# Altium schematic sheet POWER.SchDoc
size A3; SheetNumber: 4; SheetTotal: 4
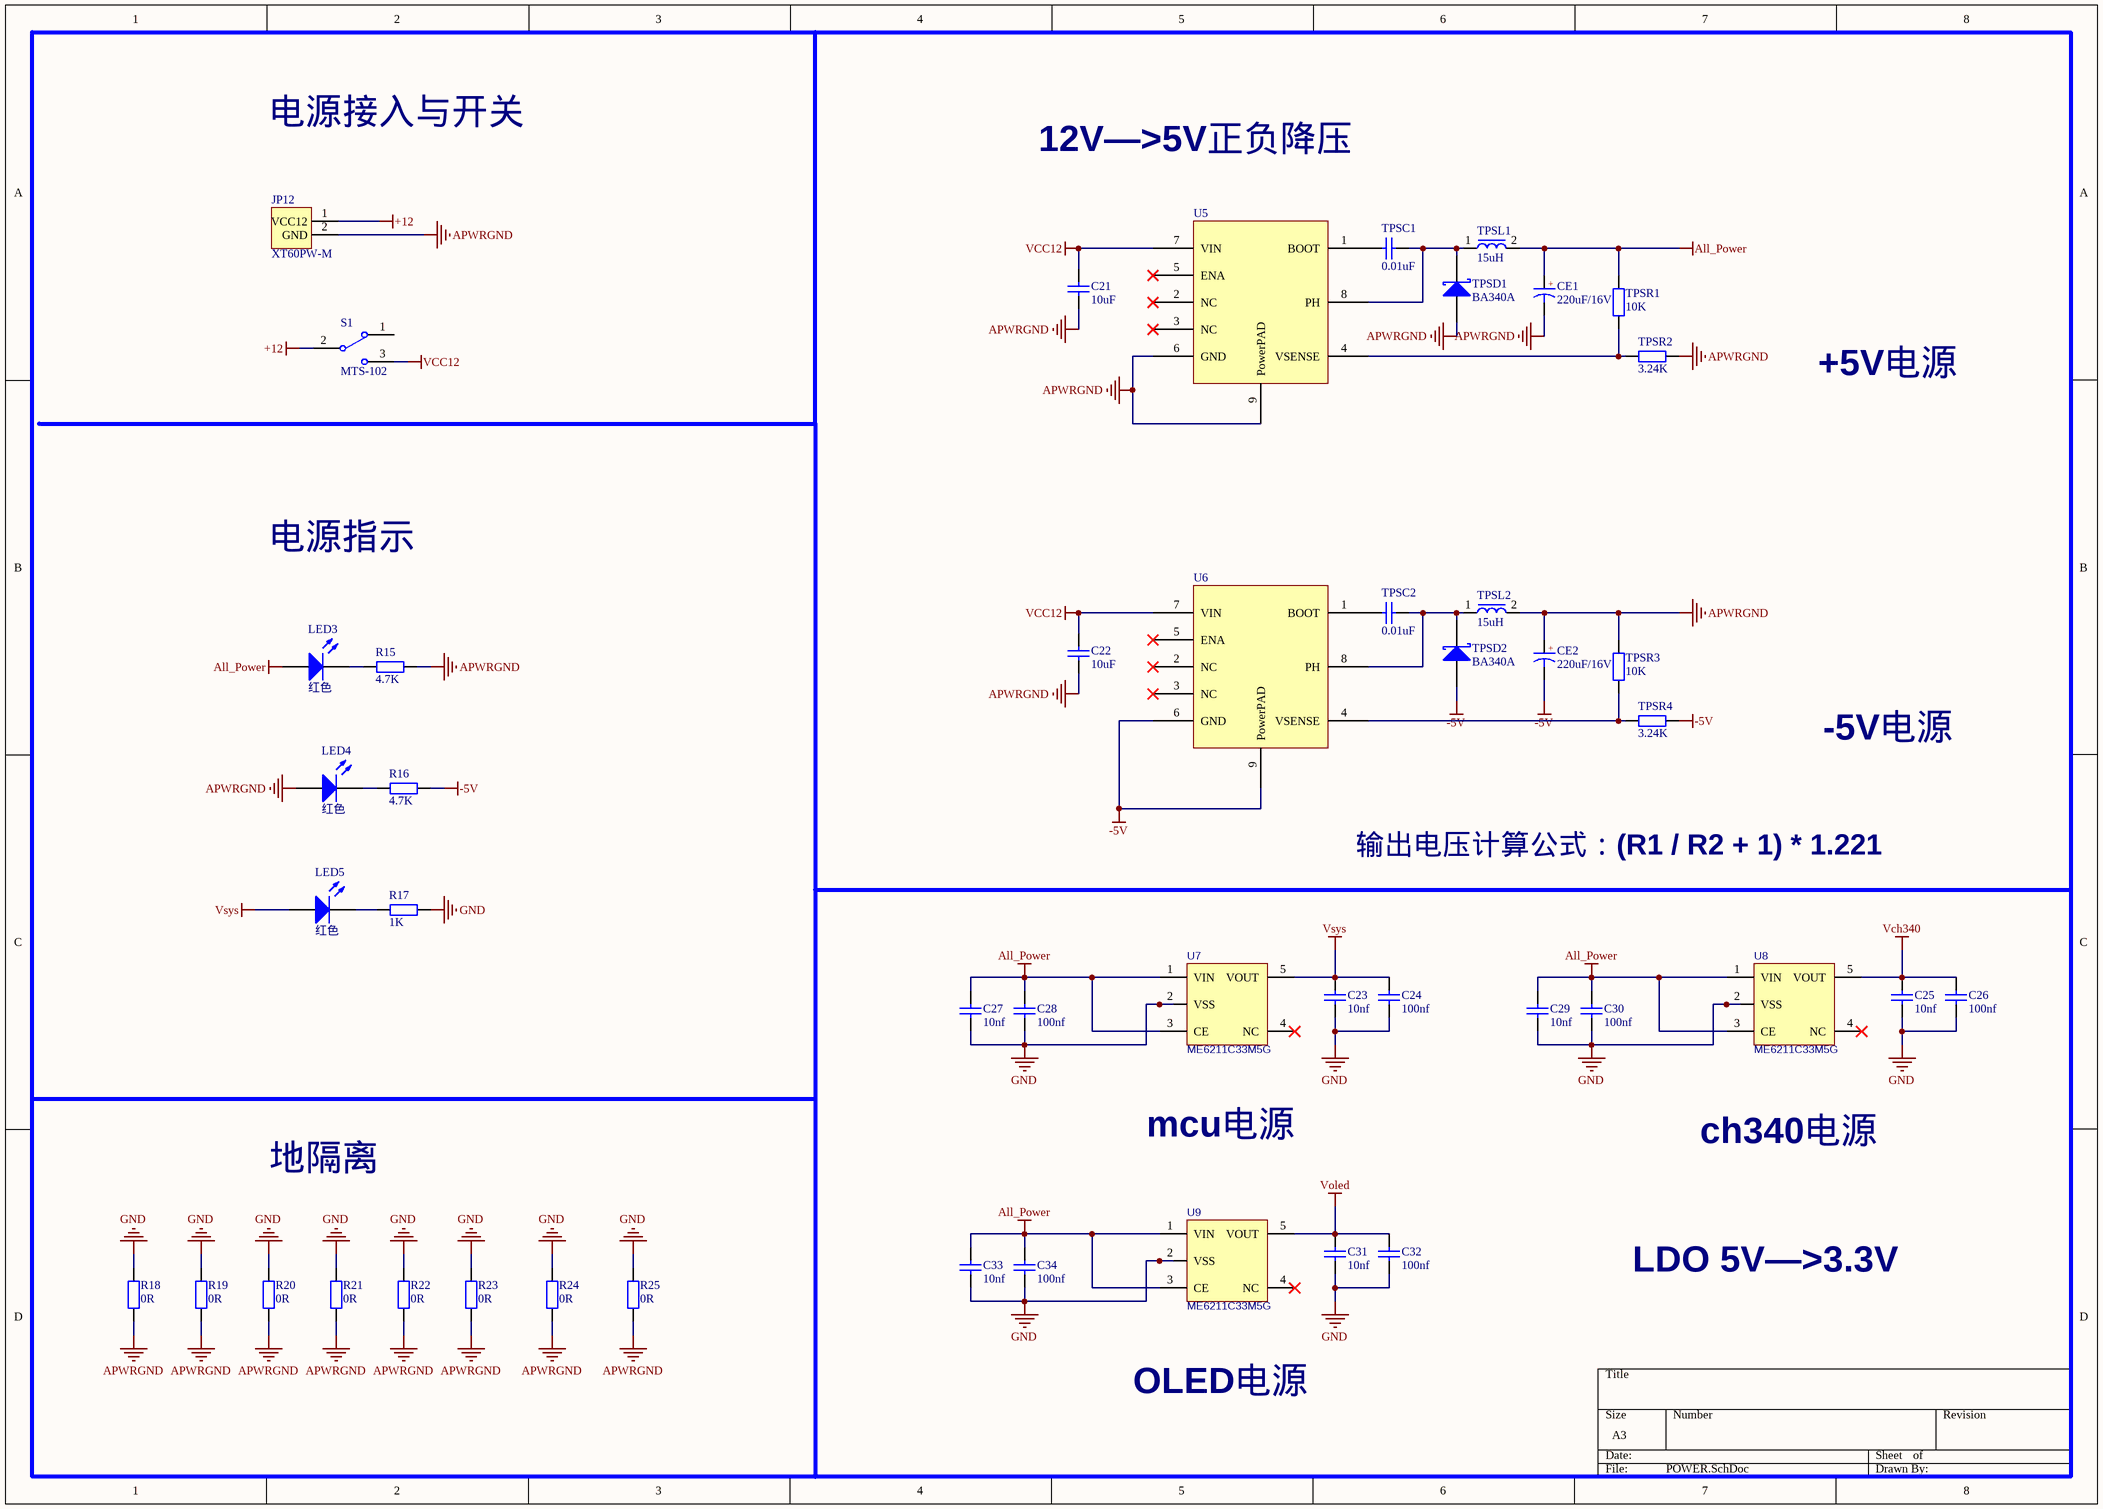
[diagram p0: POWER.SchDoc]

## Parts
C21  10uF  [C0603_M]
C22  10uF  [C0603_M]
C23  10nf  [C0603_M]
C24  100nf  [C0603_M]
C25  10nf  [C0603_M]
C26  100nf  [C0603_M]
C27  10nf  [C0603_M]
C28  100nf  [C0603_M]
C29  10nf  [C0603_M]
C30  100nf  [C0603_M]
C31  10nf  [C0603_M]
C32  100nf  [C0603_M]
C33  10nf  [C0603_M]
C34  100nf  [C0603_M]
CE1  220uF/16V  [CE D(6.3*5.4)]
CE2  220uF/16V  [CE D(6.3*5.4)]
JP12  XT60PW-M  [TX60PW-M20]
LED3  红色  [LED0603_R]
LED4  红色  [LED0603_R]
LED5  红色  [LED0603_R]
R15  4.7K  [R0603_M]
R16  4.7K  [R0603_M]
R17  1K  [R0603_M]
R18  0R  [R0603_M]
R19  0R  [R0603_M]
R20  0R  [R0603_M]
R21  0R  [R0603_M]
R22  0R  [R0603_M]
R23  0R  [R0603_M]
R24  0R  [R0603_M]
R25  0R  [R0603_M]
S1  MTS-102  [MTS-10x]
TPSC1  0.01uF  [C0603_M]
TPSC2  0.01uF  [C0603_M]
TPSD1  BA340A  [SMC]
TPSD2  BA340A  [SMC]
TPSL1  15uH  [CDRH74]
TPSL2  15uH  [CDRH74]
TPSR1  10K  [R0603_M]
TPSR2  3.24K  [R0603_M]
TPSR3  10K  [R0603_M]
TPSR4  3.24K  [R0603_M]
U5  TPS5430DDAR  [SOP8_M]  (value not drawn)
U6  TPS5430DDAR  [SOP8_M]  (value not drawn)
U7  ME6211C33M5G  [SOT23-5N]
U8  ME6211C33M5G  [SOT23-5N]
U9  ME6211C33M5G  [SOT23-5N]

## Nets
+12: JP12.1(VCC12) S1.2
-5V: CE2.2 R16.1 TPSD2.1(A) TPSR4.1 U6.6(GND) U6.9(PowerPAD)
All_Power: C27.2 C28.2 C29.2 C30.2 C33.2 C34.2 CE1.1 LED3.1(A) TPSL1.2 TPSR1.2 U7.1(VIN) U7.3(CE) U8.1(VIN) U8.3(CE) U9.1(VIN) U9.3(CE)
APWRGND: C21.1 C22.1 CE1.2 CE2.1 JP12.2(GND) LED4.1(A) R15.1 R18.2 R19.2 R20.2 R21.2 R22.2 R23.2 R24.2 R25.2 TPSD1.1(A) TPSL2.2 TPSR2.1 TPSR3.2 U5.6(GND) U5.9(PowerPAD)
GND: C23.1 C24.1 C25.1 C26.1 C27.1 C28.1 C29.1 C30.1 C31.1 C32.1 C33.1 C34.1 R17.2 R18.1 R19.1 R20.1 R21.1 R22.1 R23.1 R24.1 R25.1 U7.2(VSS) U8.2(VSS) U9.2(VSS)
VCC12: C21.2 C22.2 S1.3 U5.7(VIN) U6.7(VIN)
Vch340: C25.2 C26.2 U8.5(VOUT)
Voled: C31.2 C32.2 U9.5(VOUT)
Vsys: C23.2 C24.2 LED5.1(A) U7.5(VOUT)
NetLED3_2: LED3.2(K) R15.2
NetLED4_2: LED4.2(K) R16.2
NetLED5_2: LED5.2(K) R17.1
NetTPSC1_1: TPSC1.1 TPSD1.2(K) TPSL1.1 U5.8(PH)
NetTPSC1_2: TPSC1.2 U5.1(BOOT)
NetTPSC2_1: TPSC2.1 TPSD2.2(K) TPSL2.1 U6.8(PH)
NetTPSC2_2: TPSC2.2 U6.1(BOOT)
NetTPSR1_1: TPSR1.1 TPSR2.2 U5.4(VSENSE)
NetTPSR3_1: TPSR3.1 TPSR4.2 U6.4(VSENSE)

Not connected (* = marked no-connect by the designer): S1 1; U5 2(NC)* 3(NC)* 5(ENA)*; U6 2(NC)* 3(NC)* 5(ENA)*; U7 4(NC)*; U8 4(NC)*; U9 4(NC)*

## Notes on the sheet
- 电源接入与开关
- 12V—>5V正负降压
- +5V电源
- 电源指示
- -5V电源
- 输出电压计算公式：(R1 / R2 + 1) * 1.221
- 地隔离
- mcu电源
- ch340电源
- LDO 5V—>3.3V
- OLED电源
- (in symbol CE) +

## Library data of the parts
C21 C22 = C: 贴片电容/MLCC电容; BOM名称: 无极性贴片电容; 当前库版本V2022.11.14 @淘宝卖家:黄晶宝石: 最新版本发布https://shop463601444.taobao.com
C23-C34 = C_3: 贴片电容; BOM名称: 无极性贴片电容; 联系卖家，免费查找封装: 唯一出售店铺网址https://shop463601444.taobao.com
CE1 CE2 = CE: 直插电解电容; 联系卖家，免费查找封装: 唯一出售店铺网址https://shop463601444.taobao.com; BOM名称: 直插电解电容
JP12 = XT60PW: XT60PW-M弯插
LED3-LED5 = LED: 贴片LED; 封装库来自淘宝卖家：黄晶宝石: 其他店铺购入均为盗版封装库，无更新权益，请立即申请退款，本店现金奖励200~1000元; BOM名称: 贴片LED
R15-R17 TPSR1-TPSR4 = R: 贴片电阻; 联系卖家，免费查找封装: 唯一出售店铺网址https://shop463601444.taobao.com; BOM名称: 贴片电阻
R18-R25 = R: 贴片电阻; 联系下单店铺卖家 免费帮你查找封装: 联系下单店铺卖家 免费技术支持; BOM名称: 贴片电阻
S1 = MTS-10x: MTS10x系列3脚扭子开关; 版权归属: 源创客; BOM名称: MTS10x系列3脚扭子开关; 学习资源: www.ooocke.com
TPSC1 TPSC2 = C: 贴片电容; BOM名称: 无极性贴片电容; 联系卖家，免费查找封装: 唯一出售店铺网址https://shop463601444.taobao.com
TPSD1 TPSD2 = SS210: 肖特基二极管; 联系卖家，免费查找封装: 唯一出售店铺网址https://shop463601444.taobao.com; BOM名称: 肖特基二极管
TPSL1 TPSL2 = L 0630: SMA
U5 U6 = TPS5430DDAR: 输出额定电流3A 纹波30mV
U7-U9 = ME6211C33: LDO 3.3V/0.5A; BOM名称: RT9193-30GB; 当前库版本V2022.11.14 @淘宝卖家:黄晶宝石: 最新版本发布https://shop463601444.taobao.com